# Altium project Miniscope_USB_Control.PrjPcb
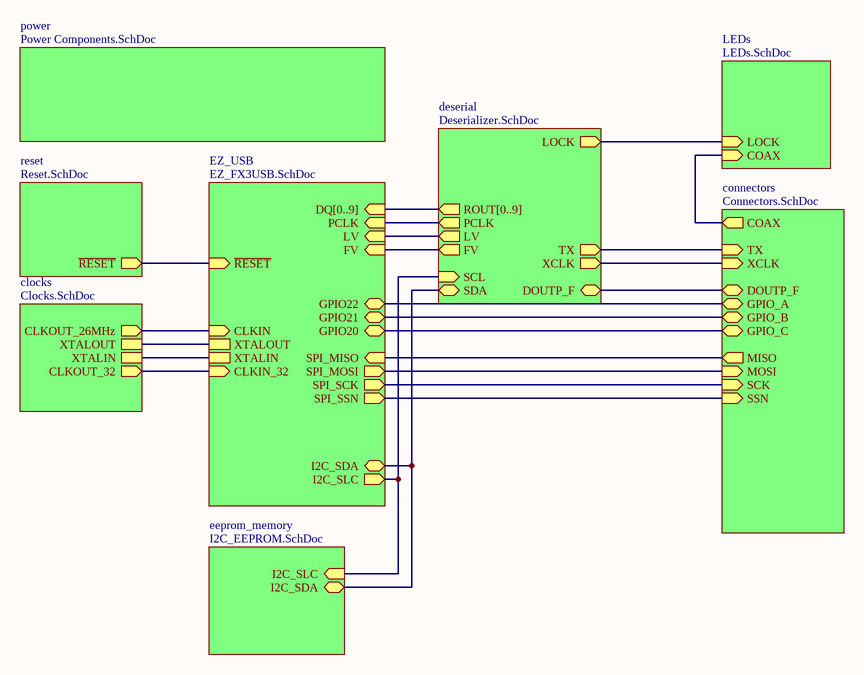
[diagram p0: USB_Control.SchDoc]
9 sheets, 208 parts. Net scope: hierarchical (ports join the sheet entries above them; power ports are global).
Board file: USB_Control.PcbDoc
Sheets:
  USB_Control.SchDoc
    deserial = Deserializer.SchDoc
    EZ_USB = EZ_FX3USB.SchDoc
    eeprom_memory = I2C_EEPROM.SchDoc
    power = Power Components.SchDoc
    connectors = Connectors.SchDoc
    reset = Reset.SchDoc
    clocks = Clocks.SchDoc
    LEDs = LEDs.SchDoc

## Sheet USB_Control.SchDoc
size A

### Sub-sheets
clocks = Clocks.SchDoc: XTALOUT, XTALIN, CLKOUT_32 (out), CLKOUT_26MHz (out)
connectors = Connectors.SchDoc: GPIO_A (bidir), GPIO_B (bidir), GPIO_C (bidir), DOUTP_F (bidir), MISO (out), MOSI (in), SCK (in), SSN (in), COAX (out), XCLK (in), TX (in)
deserial = Deserializer.SchDoc: LOCK (out), LV (out), FV (out), PCLK (out), DOUTP_F (bidir), SCL (in), SDA (bidir), ROUT[0..9] (out), XCLK (out), TX (out)
eeprom_memory = I2C_EEPROM.SchDoc: I2C_SDA (bidir), I2C_SLC (in)
EZ_USB = EZ_FX3USB.SchDoc: PCLK (in), SPI_SCK (out), SPI_SSN (out), SPI_MISO (in), SPI_MOSI (out), CLKIN_32 (in), XTALOUT, XTALIN, I2C_SDA (bidir), I2C_SLC (out), ~{RESET} (in), GPIO20 (bidir), DQ[0..9] (in), GPIO22 (bidir), GPIO21 (bidir), LV (in), FV (in), CLKIN (in)
LEDs = LEDs.SchDoc: LOCK (in), COAX (in)
power = Power Components.SchDoc: no entries
reset = Reset.SchDoc: ~{RESET} (out)

### Nets
CLKIN: sheet EZ_USB/CLKIN, sheet clocks/CLKOUT_26MHz
CLKIN_32: sheet EZ_USB/CLKIN_32, sheet clocks/CLKOUT_32
XTALIN: sheet EZ_USB/XTALIN, sheet clocks/XTALIN
XTALOUT: sheet EZ_USB/XTALOUT, sheet clocks/XTALOUT
NetC21_1: sheet deserial/DOUTP_F, sheet connectors/DOUTP_F
NetC78_1: sheet EZ_USB/~{RESET}, sheet reset/~{RESET}
NetJ3_1: sheet EZ_USB/GPIO22, sheet connectors/GPIO_A
NetJ5_1: sheet EZ_USB/GPIO20, sheet connectors/GPIO_C
NetJ8_1: sheet EZ_USB/SPI_MOSI, sheet connectors/MOSI
NetJ8_2: sheet EZ_USB/SPI_SCK, sheet connectors/SCK
NetJ8_3: sheet EZ_USB/SPI_MISO, sheet connectors/MISO
NetJ8_4: sheet EZ_USB/SPI_SSN, sheet connectors/SSN
NetJ9_2: sheet connectors/COAX, sheet LEDs/COAX
NetR9_1: sheet deserial/FV, sheet EZ_USB/FV
NetR10_1: sheet deserial/LV, sheet EZ_USB/LV
NetR12_0: sheet deserial/SCL, sheet EZ_USB/I2C_SLC, sheet eeprom_memory/I2C_SLC
NetR13_1: sheet EZ_USB/GPIO21, sheet connectors/GPIO_B
NetR14_0: sheet deserial/SDA, sheet EZ_USB/I2C_SDA, sheet eeprom_memory/I2C_SDA
NetR18_1: sheet deserial/PCLK, sheet EZ_USB/PCLK
NetR61_1: sheet deserial/LOCK, sheet LEDs/LOCK
NetU4_11: sheet deserial/XCLK, sheet connectors/XCLK
NetU4_12: sheet deserial/TX, sheet connectors/TX

### Buses and harness runs
bus sheet deserial/ROUT[0..9] = sheet EZ_USB/DQ[0..9]

## Sheet Deserializer.SchDoc
size A
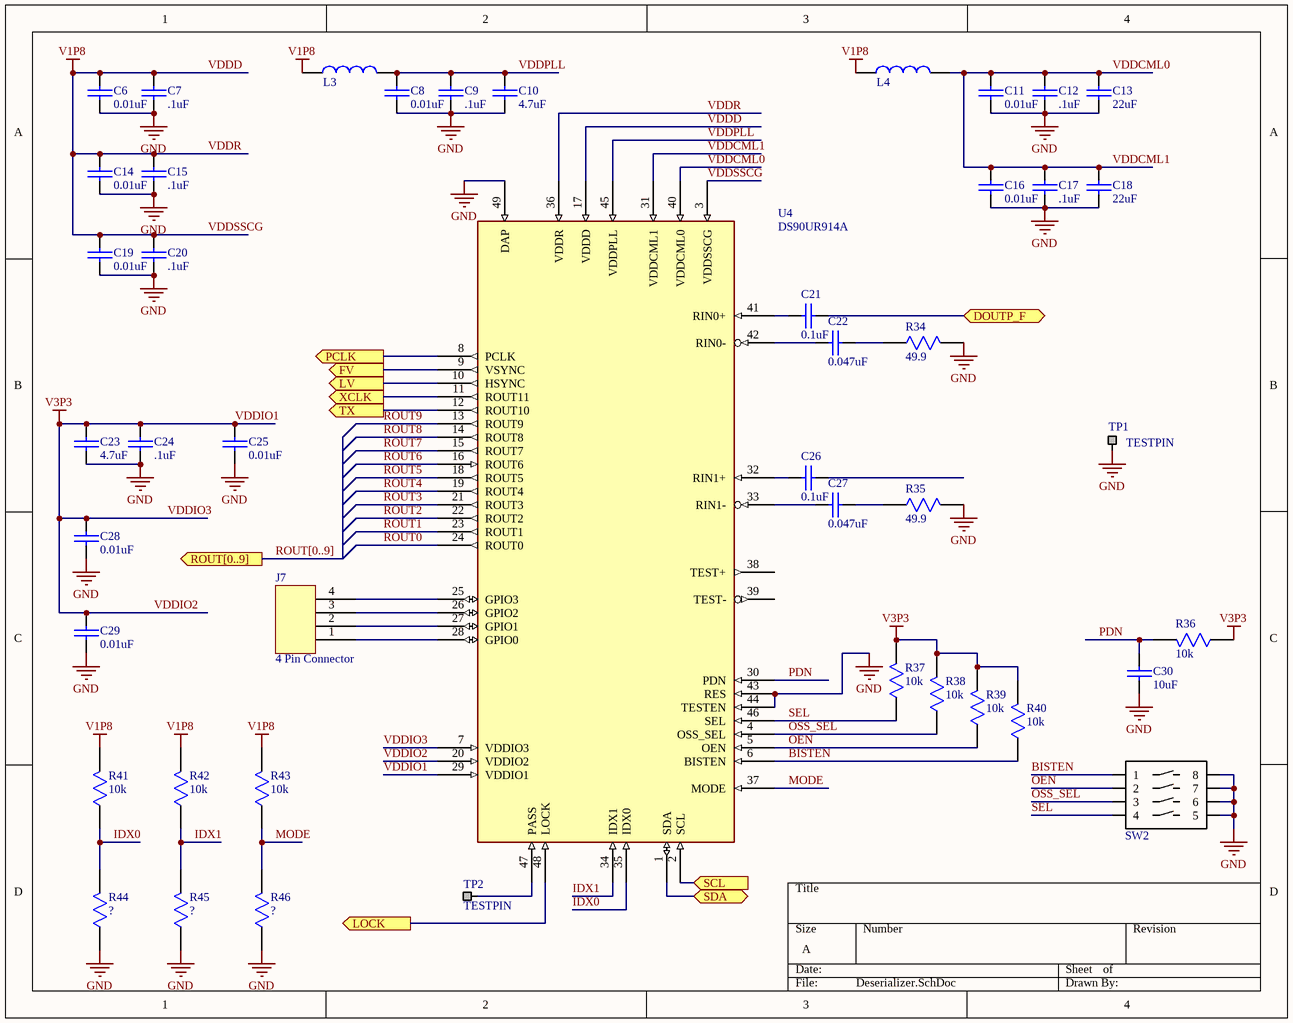
[diagram p1: Deserializer.SchDoc]

### Parts
C6  0.01uF  [SMD Capacitor 0603]
C7  .1uF  [SMD Capacitor 0603]
C8  0.01uF  [SMD Capacitor 0603]
C9  .1uF  [SMD Capacitor 0603]
C10  4.7uF  [SMD Capacitor 0603]
C11  0.01uF  [SMD Capacitor 0603]
C12  .1uF  [SMD Capacitor 0603]
C13  22uF  [SMD Capacitor 0603]
C14  0.01uF  [SMD Capacitor 0603]
C15  .1uF  [SMD Capacitor 0603]
C16  0.01uF  [SMD Capacitor 0603]
C17  .1uF  [SMD Capacitor 0603]
C18  22uF  [SMD Capacitor 0603]
C19  0.01uF  [SMD Capacitor 0603]
C20  .1uF  [SMD Capacitor 0603]
C21  0.1uF  [SMD CAP 0402]
C22  0.047uF  [SMD CAP 0402]
C23  4.7uF  [SMD Capacitor 0603]
C24  .1uF  [SMD Capacitor 0603]
C25  0.01uF  [SMD Capacitor 0603]
C26  0.1uF  [SMD CAP 0402]
C27  0.047uF  [SMD CAP 0402]
C28  0.01uF  [SMD Capacitor 0603]
C29  0.01uF  [SMD Capacitor 0603]
C30  10uF  [SMD Capacitor 0603]
J7  4 Pin Connector  [4Pin Verital 0.1"]
L3  Ferrite Bead  [BLM18KG601SN1D]  (value not drawn)
L4  Ferrite Bead  [BLM18KG601SN1D]  (value not drawn)
R34  49.9  [SMD RES 0402]
R35  49.9  [SMD RES 0402]
R36  10k  [SMD Resistor 0603]
R37  10k  [SMD Resistor 0603]
R38  10k  [SMD Resistor 0603]
R39  10k  [SMD Resistor 0603]
R40  10k  [SMD Resistor 0603]
R41  10k  [SMD Resistor 0603]
R42  10k  [SMD Resistor 0603]
R43  10k  [SMD Resistor 0603]
R44  ?  [SMD Resistor 0603]
R45  ?  [SMD Resistor 0603]
R46  ?  [SMD Resistor 0603]
SW2  SW_DIP_4Position  [218-4LPST]  (value not drawn)
TP1  TESTPIN  [TESTPIN]
TP2  TESTPIN  [TESTPIN]
U4  DS90UR914A  [WQFN48 for DS90UB914A]

### Ports
DOUTP_F (bidir), FV (out), LOCK (out), LV (out), PCLK (out), ROUT[0..9] (out), SCL (in), SDA (bidir), TX (out), XCLK (out)

### Nets
GND: C6.1 C7.1 C8.1 C9.1 C10.1 C11.1 C12.1 C13.1 C14.1 C15.1 C16.1 C17.1 C18.1 C19.1 C20.1 C23.1 C24.1 C25.1 C28.1 C29.1 C30.1 R34.1 R35.1 R44.0 R45.0 R46.0 SW2.5 SW2.6 SW2.7 SW2.8 TP1.1 U4.43(RES) U4.44(TESTEN) U4.49(DAP)
VDDD: C6.0 C7.0 C14.0 C15.0 C19.0 C20.0 L3.1 L4.1 R41.1 R42.1 R43.1 U4.3(VDDSSCG) U4.17(VDDD) U4.36(VDDR)  [also labelled V1P8, VDDR, VDDSSCG]
VDDIO1: C23.0 C24.0 C25.0 C28.0 C29.0 R36.0 R37.1 R38.1 R39.1 R40.1 U4.7(VDDIO3) U4.20(VDDIO2) U4.29(VDDIO1)  [also labelled V3P3, VDDIO2, VDDIO3]
BISTEN: R40.0 SW2.1 U4.6(BISTEN)
IDX0: R41.0 R44.1 U4.35(IDX0)
IDX1: R42.0 R45.1 U4.34(IDX1)
MODE: R43.0 R46.1 U4.37(MODE)
OEN: R39.0 SW2.2 U4.5(OEN)
OSS_SEL: R38.0 SW2.3 U4.4(OSS_SEL)
PDN: C30.0 R36.1 U4.30(PDN)
ROUT0: U4.24(ROUT0)  [project net DQ0]
ROUT1: U4.23(ROUT1)  [project net DQ1]
ROUT2: U4.22(ROUT2)  [project net DQ2]
ROUT3: U4.21(ROUT3)  [project net DQ3]
ROUT4: U4.19(ROUT4)  [project net DQ4]
ROUT5: U4.18(ROUT5)  [project net DQ5]
ROUT6: U4.16(ROUT6)  [project net DQ6]
ROUT7: U4.15(ROUT7)  [project net DQ7]
ROUT8: U4.14(ROUT8)  [project net DQ8]
ROUT9: U4.13(ROUT9)  [project net DQ9]
SEL: R37.0 SW2.4 U4.46(SEL)
VDDCML0: C11.0 C12.0 C13.0 C16.0 C17.0 C18.0 L4.2 U4.31(VDDCML1) U4.40(VDDCML0)  [also labelled VDDCML1]
VDDPLL: C8.0 C9.0 C10.0 L3.2 U4.45(VDDPLL)
NetC21_0: C21.0 U4.41(RIN0+)
NetC21_1: C21.1 ; port DOUTP_F
NetC22_0: C22.0 U4.42(RIN0-)
NetC22_1: C22.1 R34.0
NetC26_0: C26.0 U4.32(RIN1+)
NetC27_0: C27.0 U4.33(RIN1-)
NetC27_1: C27.1 R35.0
NetJ7_1: J7.1 U4.28(GPIO0)
NetJ7_2: J7.2 U4.27(GPIO1)
NetJ7_3: J7.3 U4.26(GPIO2)
NetJ7_4: J7.4 U4.25(GPIO3)
NetR9_1: U4.9(VSYNC) ; port FV
NetR10_1: U4.10(HSYNC) ; port LV
NetR12_0: U4.2(SCL) ; port SCL
NetR14_0: U4.1(SDA) ; port SDA
NetR18_1: U4.8(PCLK) ; port PCLK
NetR61_1: U4.48(LOCK) ; port LOCK
NetTP2_1: TP2.1 U4.47(PASS)
NetU4_11: U4.11(ROUT11) ; port XCLK
NetU4_12: U4.12(ROUT10) ; port TX

Not connected (* = marked no-connect by the designer): C26 1; U4 38(TEST+) 39(TEST-)

### Buses and harness runs
bus ROUT[0..9] = port ROUT[0..9]

### Library data of the parts
C6-C30 = Capacitor: Value: C?
R34-R46 = Resistor: Value: ?
TP1 TP2 = TESTPIN: TESTPIN SINGLE PIN HEADER; Manufacturer 1: Sharon Long Industries; Manufacturer Part Number 1: Cut-it-yourself; Reel: TH; Supplier 1: Sharon Long Industries; Supplier 1 Part number: Cut-It-Yourself

## Sheet EZ_FX3USB.SchDoc
size A
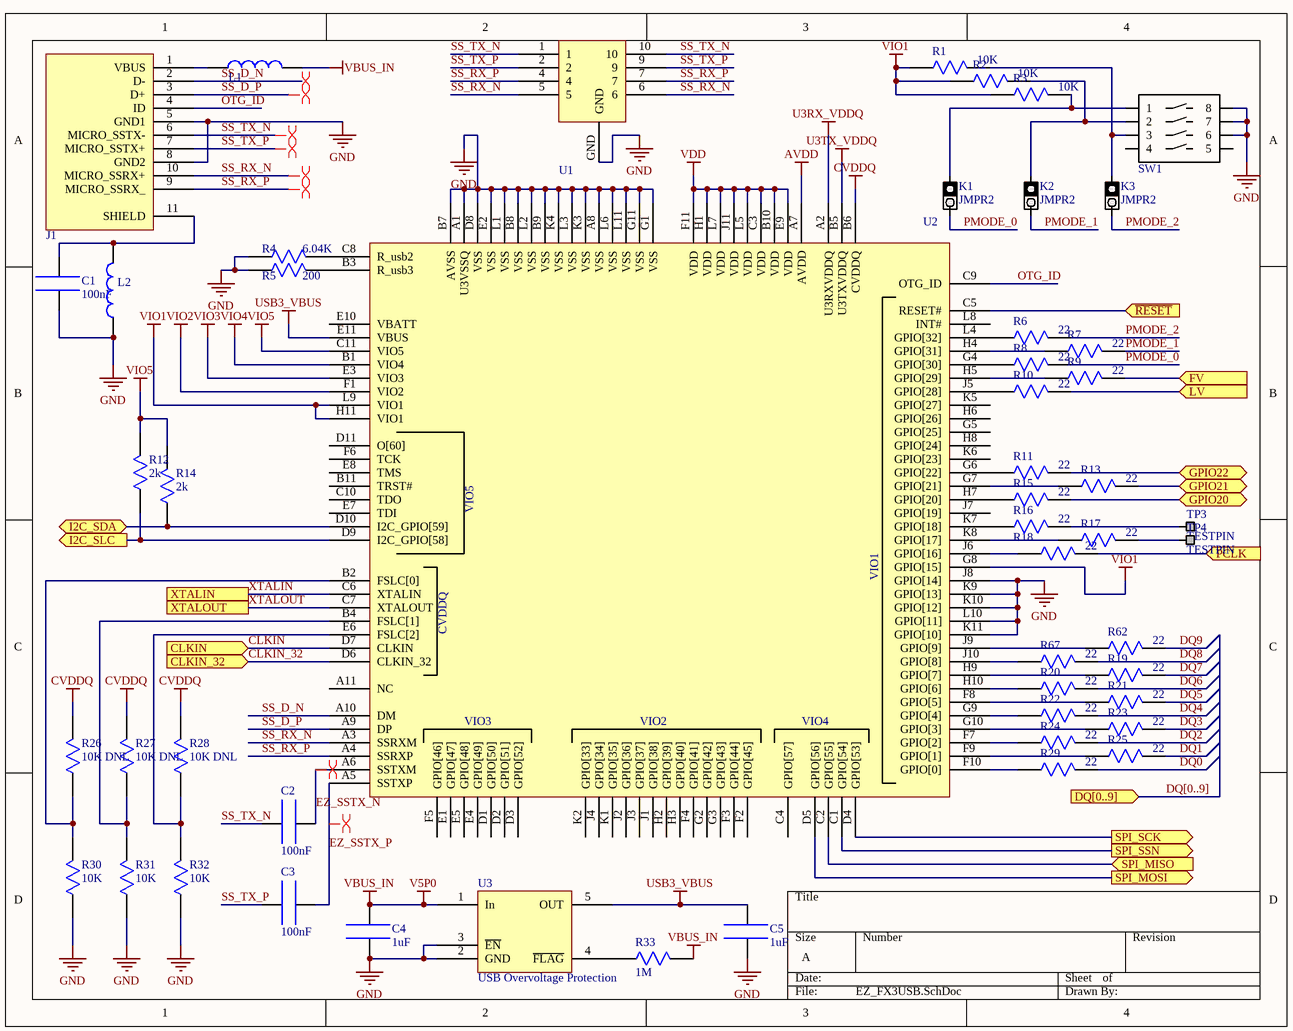
[diagram p2: EZ_FX3USB.SchDoc]

### Parts
C1  value 100nF  [SMD Capacitor 0603]  (hidden comment: Capacitor)
C2  value 100nF  [SMD Capacitor 0603]  (hidden comment: Capacitor)
C3  value 100nF  [SMD Capacitor 0603]  (hidden comment: Capacitor)
C4  value 1uF  [SMD Capacitor 0603]  (hidden comment: Capacitor)
C5  value 1uF  [SMD Capacitor 0603]  (hidden comment: Capacitor)
J1  USB3 MicroB  [PCBComponent_1]  (value not drawn)
K1  JMPR2  [JMPR2]
K2  JMPR2  [JMPR2]
K3  JMPR2  [JMPR2]
L1  Ferrite Bead  [BLM21PG221SN1D_0805]  (value not drawn)
L2  Ferrite Bead  [BLM21PG221SN1D_0805]  (value not drawn)
R1  10K  [SMD Resistor 0603]
R2  value 10K  [SMD Resistor 0603]  (hidden comment: Resistor)
R3  value 10K  [SMD Resistor 0603]  (hidden comment: Resistor)
R4  value 6.04K  [SMD Resistor 0603]  (hidden comment: Resistor)
R5  value 200  [SMD Resistor 0603]  (hidden comment: Resistor)
R6  value 22  [SMD Resistor 0603]  (hidden comment: "=Value")
R7  value 22  [SMD Resistor 0603]  (hidden comment: Resistor)
R8  value 22  [SMD Resistor 0603]  (hidden comment: Resistor)
R9  value 22  [SMD Resistor 0603]  (hidden comment: Resistor)
R10  value 22  [SMD Resistor 0603]  (hidden comment: Resistor)
R11  value 22  [SMD Resistor 0603]  (hidden comment: Resistor)
R12  value 2k  [SMD Resistor 0603]  (hidden comment: Resistor)
R13  value 22  [SMD Resistor 0603]  (hidden comment: Resistor)
R14  value 2k  [SMD Resistor 0603]  (hidden comment: Resistor)
R15  value 22  [SMD Resistor 0603]  (hidden comment: Resistor)
R16  value 22  [SMD Resistor 0603]  (hidden comment: Resistor)
R17  value 22  [SMD Resistor 0603]  (hidden comment: Resistor)
R18  value 22  [SMD Resistor 0603]  (hidden comment: Resistor)
R19  value 22  [SMD Resistor 0603]  (hidden comment: Resistor)
R20  value 22  [SMD Resistor 0603]  (hidden comment: Resistor)
R21  value 22  [SMD Resistor 0603]  (hidden comment: Resistor)
R22  value 22  [SMD Resistor 0603]  (hidden comment: Resistor)
R23  value 22  [SMD Resistor 0603]  (hidden comment: Resistor)
R24  value 22  [SMD Resistor 0603]  (hidden comment: Resistor)
R25  value 22  [SMD Resistor 0603]  (hidden comment: Resistor)
R26  value 10K DNL  [SMD Resistor 0603]  (hidden comment: Resistor)
R27  value 10K DNL  [SMD Resistor 0603]  (hidden comment: Resistor)
R28  value 10K DNL  [SMD Resistor 0603]  (hidden comment: Resistor)
R29  value 22  [SMD Resistor 0603]  (hidden comment: Resistor)
R30  value 10K  [SMD Resistor 0603]  (hidden comment: Resistor)
R31  value 10K  [SMD Resistor 0603]  (hidden comment: Resistor)
R32  value 10K  [SMD Resistor 0603]  (hidden comment: Resistor)
R33  value 1M  [SMD Resistor 0603]  (hidden comment: Resistor)
R62  value 22  [SMD Resistor 0603]  (hidden comment: Resistor)
R67  value 22  [SMD Resistor 0603]  (hidden comment: Resistor)
SW1  SW_DIP_4Position  [218-4LPST]  (value not drawn)
TP3  TESTPIN  [TESTPIN]
TP4  TESTPIN  [TESTPIN]
U1  ESD_4Channel  [SP3010-04UTG]  (value not drawn)
U2  EZ FX3 USB  [BGA121C80P11X11_1000X1000X100]  (value not drawn)
U3  USB Overvoltage Protection  [TSOP-5 _ NCP361SNT1G]

### Ports
CLKIN (in), CLKIN_32 (in), DQ[0..9] (in), FV (in), GPIO20 (bidir), GPIO21 (bidir), GPIO22 (bidir), I2C_SDA (bidir), I2C_SLC (out), LV (in), PCLK (in), SPI_MISO (in), SPI_MOSI (out), SPI_SCK (out), SPI_SSN (out), XTALIN, XTALOUT, ~{RESET} (in)

### Nets
AVDD: U2.A7(AVDD)
CVDDQ: R26.1 R27.1 R28.1 U2.B6(CVDDQ)
GND: C1.0 C4.0 C5.0 J1.5(GND1) J1.8(GND2) L2.1 R4.0 R5.0 R30.0 R31.0 R32.0 SW1.6 SW1.7 SW1.8 U1.GND U2.A1(U3VSSQ) U2.A8(VSS) U2.B7(AVSS) U2.B8(VSS) U2.B9(VSS) U2.D8(VSS) U2.E2(VSS) U2.G1(VSS) U2.G11(VSS) U2.J8(GPIO[14]) U2.K3(VSS) U2.K4(VSS) U2.K9(GPIO[13]) U2.K10(GPIO[12]) U2.K11(GPIO[10]) U2.L1(VSS) U2.L2(VSS) U2.L3(VSS) U2.L6(VSS) U2.L10(GPIO[11]) U2.L11(VSS) U3.2(GND) U3.3(~{EN})
U3RX_VDDQ: U2.A2(U3RXVDDQ)
U3TX_VDDQ: U2.B5(U3TXVDDQ)
USB3_VBUS: C5.1 U2.E11(VBUS) U3.5(OUT)
V5P0: C4.1 L1.2 R33.1 U3.1(In)  [also labelled VBUS_IN]
VDD: U2.B10(VDD) U2.C3(VDD) U2.E9(VDD) U2.F11(VDD) U2.H1(VDD) U2.J11(VDD) U2.L5(VDD) U2.L7(VDD)
VIO1: R1.0 R2.0 R3.0 R12.1 R14.1 U2.B1(VIO4) U2.C11(VIO5) U2.E3(VIO3) U2.F1(VIO2) U2.G8(GPIO[15]) U2.H11(VIO1) U2.L9(VIO1)  [also labelled VIO2, VIO3, VIO4, VIO5]  [project net VDDIO1]
CLKIN: U2.D7(CLKIN) ; port CLKIN
CLKIN_32: U2.D6(CLKIN_32) ; port CLKIN_32
DQ0: R29.1
DQ1: R25.1
DQ2: R24.1
DQ3: R23.1
DQ4: R22.1
DQ5: R21.1
DQ6: R20.1
DQ7: R19.1
DQ8: R67.1
DQ9: R62.1
EZ_SSTX_N: C2.1 U2.A6(SSTXM)
EZ_SSTX_P: C3.1 U2.A5(SSTXP)
OTG_ID: J1.4(ID) U2.C9(OTG_ID)
PMODE_0: K1.2 R8.1
PMODE_1: K2.2 R7.1
PMODE_2: K3.2 R6.1
SS_D_N: J1.2(D-) U2.A10(DM)
SS_D_P: J1.3(D+) U2.A9(DP)
SS_RX_N: J1.10(MICRO_SSRX+) U1.5 U1.6 U2.A3(SSRXM)
SS_RX_P: J1.9(MICRO_SSRX_) U1.4 U1.7 U2.A4(SSRXP)
SS_TX_N: C2.0 J1.6(MICRO_SSTX-) U1.1 U1.10
SS_TX_P: C3.0 J1.7(MICRO_SSTX+) U1.2 U1.9
XTALIN: U2.C6(XTALIN) ; port XTALIN
XTALOUT: U2.C7(XTALOUT) ; port XTALOUT
NetC1_1: C1.1 J1.11(SHIELD) L2.2
NetC78_1: U2.C5(RESET#) ; port ~{RESET}
NetJ1_1: J1.1(VBUS) L1.1
NetJ3_1: R11.1 ; port GPIO22
NetJ5_1: R15.1 ; port GPIO20
NetJ8_1: U2.D5(GPIO[56]) ; port SPI_MOSI
NetJ8_2: U2.D4(GPIO[53]) ; port SPI_SCK
NetJ8_3: U2.C2(GPIO[55]) ; port SPI_MISO
NetJ8_4: U2.C1(GPIO[54]) ; port SPI_SSN
NetK1_1: K1.1 R3.1 SW1.1
NetK2_1: K2.1 R2.1 SW1.2
NetK3_1: K3.1 R1.1 SW1.3
NetR4_1: R4.1 U2.C8(R_usb2)
NetR5_1: R5.1 U2.B3(R_usb3)
NetR6_0: R6.0 U2.L4(GPIO[32])
NetR7_0: R7.0 U2.H4(GPIO[31])
NetR8_0: R8.0 U2.G4(GPIO[30])
NetR9_0: R9.0 U2.H5(GPIO[29])
NetR9_1: R9.1 ; port FV
NetR10_0: R10.0 U2.J5(GPIO[28])
NetR10_1: R10.1 ; port LV
NetR11_0: R11.0 U2.G6(GPIO[22])
NetR12_0: R12.0 U2.D9(I2C_GPIO[58]) ; port I2C_SLC
NetR13_0: R13.0 U2.G7(GPIO[21])
NetR13_1: R13.1 ; port GPIO21
NetR14_0: R14.0 U2.D10(I2C_GPIO[59]) ; port I2C_SDA
NetR15_0: R15.0 U2.H7(GPIO[20])
NetR16_0: R16.0 U2.K7(GPIO[18])
NetR16_1: R16.1 TP3.1
NetR17_0: R17.0 U2.K8(GPIO[17])
NetR17_1: R17.1 TP4.1
NetR18_0: R18.0 U2.J6(GPIO[16])
NetR18_1: R18.1 ; port PCLK
NetR19_0: R19.0 U2.H9(GPIO[7])
NetR20_0: R20.0 U2.H10(GPIO[6])
NetR21_0: R21.0 U2.F8(GPIO[5])
NetR22_0: R22.0 U2.G9(GPIO[4])
NetR23_0: R23.0 U2.G10(GPIO[3])
NetR24_0: R24.0 U2.F7(GPIO[2])
NetR25_0: R25.0 U2.F9(GPIO[1])
NetR26_0: R26.0 R30.1 U2.B2(FSLC[0])
NetR27_0: R27.0 R31.1 U2.B4(FSLC[1])
NetR28_0: R28.0 R32.1 U2.E6(FSLC[2])
NetR29_0: R29.0 U2.F10(GPIO[0])
NetR33_0: R33.0 U3.4(~{FLAG})
NetR62_0: R62.0 U2.J9(GPIO[9])
NetR67_0: R67.0 U2.J10(GPIO[8])

Not connected (* = marked no-connect by the designer): SW1 4 5; U2 A11(NC) B11(TRST#) C4(GPIO[57]) C10(TDO) D1(GPIO[50]) D2(GPIO[51]) D3(GPIO[52]) D11(O[60]) E1(GPIO[47]) E4(GPIO[49]) E5(GPIO[48]) E7(TDI) E8(TMS) E10(VBATT) F2(GPIO[45]) F3(GPIO[44]) F4(GPIO[41]) F5(GPIO[46]) F6(TCK) G2(GPIO[42]) G3(GPIO[43]) G5(GPIO[25]) H2(GPIO[39]) H3(GPIO[40]) H6(GPIO[26]) H8(GPIO[24]) J1(GPIO[38]) J2(GPIO[36]) J3(GPIO[37]) J4(GPIO[34]) J7(GPIO[19]) K1(GPIO[35]) K2(GPIO[33]) K5(GPIO[27]) K6(GPIO[23]) L8(INT#)

### Buses and harness runs
bus DQ[0..9] = port DQ[0..9]

### Layout directives
differential pair: EZ_SSTX_N, EZ_SSTX_P, SS_D_N, SS_D_P, SS_RX_N, SS_RX_P, SS_TX_N, SS_TX_P

### Library data of the parts
K1-K3 = JMPR2: JMPR2 OPEN BY DEFAULT; Manufacturer: Sullins Connector Solutions; Manufacturer Part Number: PBC36SAAN; Supplier 1: Digi-Key; Supplier Part Number 1: S1011E-36-ND; Reel: Open
R1 R6 = Resistor
  R1: Value: 10K
TP3 TP4 = TESTPIN: as TP1 on sheet Deserializer; Supplier 1: Sharon Long Industries; Supplier 1 Part number: Cut-It-Yourself

## Sheet I2C_EEPROM.SchDoc
size A
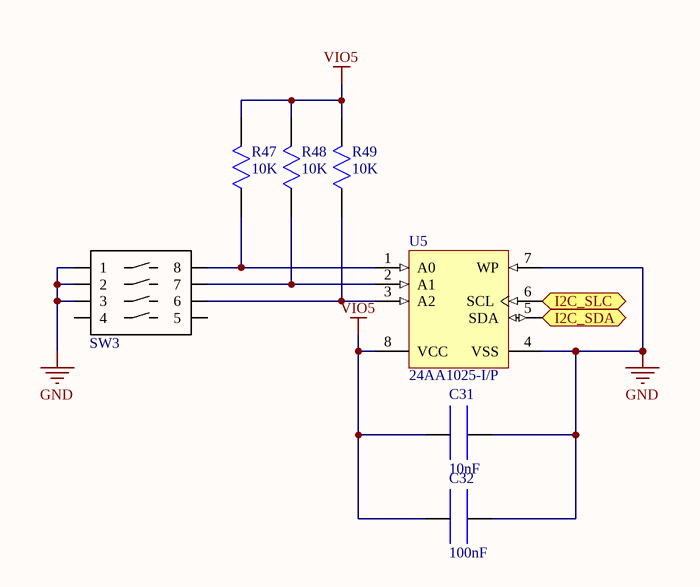
[diagram p3: I2C_EEPROM.SchDoc]

### Parts
C31  value 10nF  [SMD Capacitor 0603]  (hidden comment: Capacitor)
C32  value 100nF  [SMD Capacitor 0603]  (hidden comment: Capacitor)
R47  value 10K  [SMD Resistor 0603]  (hidden comment: Resistor)
R48  value 10K  [SMD Resistor 0603]  (hidden comment: Resistor)
R49  value 10K  [SMD Resistor 0603]  (hidden comment: Resistor)
SW3  SW_DIP_4Position  [218-4LPST]  (value not drawn)
U5  24AA1025-I/P  [PDIP300-P8]

### Ports
I2C_SDA (bidir), I2C_SLC (in)

### Nets
GND: C31.1 C32.1 SW3.1 SW3.2 SW3.3 U5.4(VSS) U5.7(WP)
VIO5: C31.0 C32.0 R47.1 R48.1 R49.1 U5.8(VCC)  [project net VDDIO1]
NetR12_0: U5.6(SCL) ; port I2C_SLC
NetR14_0: U5.5(SDA) ; port I2C_SDA
NetR47_0: R47.0 SW3.8 U5.1(A0)
NetR48_0: R48.0 SW3.7 U5.2(A1)
NetR49_0: R49.0 SW3.6 U5.3(A2)

Not connected (* = marked no-connect by the designer): SW3 4 5

### Library data of the parts
U5 = 24AA1025-I/P: 1 Mbit, 400kHz, 1.7V, I2C Serial EEPROM, 8-Pin PDIP, Industrial Temperature; Manufacturer: Microchip; DatasheetVersion: revF, Oct-2008; PackageVersion: revBB, Aug-2009; PackageReference: PDIP300-P8; PackageDescription: 8-Lead Plastic Dual In-Line (P) - 300 mil Body [PDIP]; Supplier 1: Digi-Key; Supplier Part Number 1: 24AA1025-I/P-ND; Supplier 2: Farnell; Supplier Part Number 2: 1467720; Supplier 3: Newark; Supplier Part Number 3: 56K7661; Supplier 4: Mouser; Supplier Part Number 4: 579-24AA1025-I/P; Mounting Technology: Through Hole; Code_JEDEC: MS-001; PartNumber: 24AA1025-I/P; ComponentLink1Description: Manufacturer URL; ComponentLink1URL: http://www.microchip.com/; ComponentLink2Description: Datasheet; ComponentLink2URL: http://ww1.microchip.com/downloads/en/DeviceDoc/21941F.pdf; ComponentLink3Description: Package Specification; ComponentLink3URL: http://www.microchip.com/stellent/groups/techpub_sg/documents/packagingspec/en012702.pdf

## Sheet Power Components.SchDoc
size A
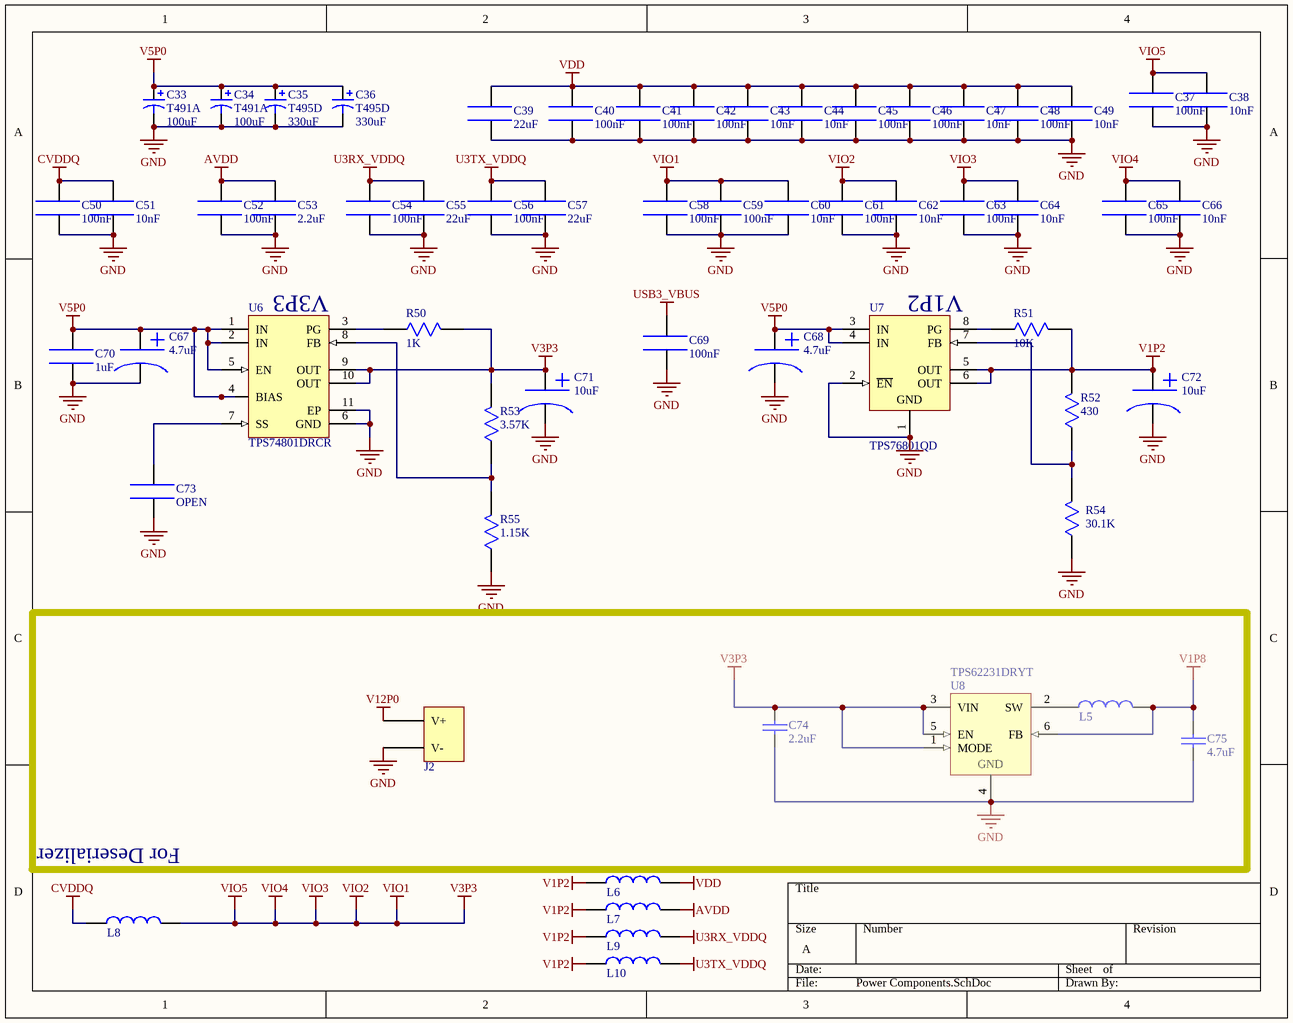
[diagram p4: Power Components.SchDoc]

### Parts
C33  T491A  value 100uF  [A]
C34  T491A  value 100uF  [A]
C35  T495D  value 330uF  [D]
C36  T495D  value 330uF  [D]
C37  value 100nF  [SMD Capacitor 0603]  (hidden comment: Capacitor)
C38  value 10nF  [SMD Capacitor 0603]  (hidden comment: Capacitor)
C39  value 22uF  [SMD Capacitor 0603]  (hidden comment: Capacitor)
C40  value 100nF  [SMD Capacitor 0603]  (hidden comment: Capacitor)
C41  value 100nF  [SMD Capacitor 0603]  (hidden comment: Capacitor)
C42  value 100nF  [SMD Capacitor 0603]  (hidden comment: Capacitor)
C43  value 10nF  [SMD Capacitor 0603]  (hidden comment: Capacitor)
C44  value 10nF  [SMD Capacitor 0603]  (hidden comment: Capacitor)
C45  value 100nF  [SMD Capacitor 0603]  (hidden comment: Capacitor)
C46  value 100nF  [SMD Capacitor 0603]  (hidden comment: Capacitor)
C47  value 10nF  [SMD Capacitor 0603]  (hidden comment: Capacitor)
C48  value 100nF  [SMD Capacitor 0603]  (hidden comment: Capacitor)
C49  value 10nF  [SMD Capacitor 0603]  (hidden comment: Capacitor)
C50  value 100nF  [SMD Capacitor 0603]  (hidden comment: Capacitor)
C51  value 10nF  [SMD Capacitor 0603]  (hidden comment: Capacitor)
C52  value 100nF  [SMD Capacitor 0603]  (hidden comment: Capacitor)
C53  value 2.2uF  [SMD Capacitor 0603]  (hidden comment: Capacitor)
C54  value 100nF  [SMD Capacitor 0603]  (hidden comment: Capacitor)
C55  value 22uF  [SMD Capacitor 0603]  (hidden comment: Capacitor)
C56  value 100nF  [SMD Capacitor 0603]  (hidden comment: Capacitor)
C57  value 22uF  [SMD Capacitor 0603]  (hidden comment: Capacitor)
C58  value 100nF  [SMD Capacitor 0603]  (hidden comment: Capacitor)
C59  value 100nF  [SMD Capacitor 0603]  (hidden comment: Capacitor)
C60  value 10nF  [SMD Capacitor 0603]  (hidden comment: Capacitor)
C61  value 100nF  [SMD Capacitor 0603]  (hidden comment: Capacitor)
C62  value 10nF  [SMD Capacitor 0603]  (hidden comment: Capacitor)
C63  value 100nF  [SMD Capacitor 0603]  (hidden comment: Capacitor)
C64  value 10nF  [SMD Capacitor 0603]  (hidden comment: Capacitor)
C65  value 100nF  [SMD Capacitor 0603]  (hidden comment: Capacitor)
C66  value 10nF  [SMD Capacitor 0603]  (hidden comment: Capacitor)
C67  value 4.7uF  [Capacitor Polarized 0603]  (hidden comment: Capacitor Polarized)
C68  value 4.7uF  [Capacitor Polarized 0603]  (hidden comment: Capacitor Polarized)
C69  value 100nF  [SMD Capacitor 0603]  (hidden comment: Capacitor)
C70  value 1uF  [SMD Capacitor 0603]  (hidden comment: Capacitor)
C71  value 10uF  [Capacitor Polarized 0603]  (hidden comment: Capacitor Polarized)
C72  value 10uF  [Capacitor Polarized 0603]  (hidden comment: Capacitor Polarized)
C73  value OPEN  [SMD Capacitor 0603]  (hidden comment: Capacitor)
C74  2.2uF  [SMD Capacitor 0603]
C75  4.7uF  [SMD Capacitor 0603]
J2  DC-Power Jack  [PCBComponent_1 - duplicate]  (value not drawn)
L5  Ferrite Bead  [LQM21PN2R2MC0D]  (value not drawn)
L6  Ferrite Bead  [MPZ2012S601A]  (value not drawn)
L7  Ferrite Bead  [MPZ2012S601A]  (value not drawn)
L8  Ferrite Bead  [MPZ2012S601A]  (value not drawn)
L9  Ferrite Bead  [MPZ2012S601A]  (value not drawn)
L10  Ferrite Bead  [MPZ2012S601A]  (value not drawn)
R50  value 1K  [SMD Resistor 0603]  (hidden comment: Resistor)
R51  value 10K  [SMD Resistor 0603]  (hidden comment: Resistor)
R52  value 430  [SMD Resistor 0603]  (hidden comment: Resistor)
R53  value 3.57K  [SMD Resistor 0603]  (hidden comment: Resistor)
R54  value 30.1K  [SMD Resistor 0603]  (hidden comment: Resistor)
R55  value 1.15K  [SMD Resistor 0603]  (hidden comment: Resistor)
U6  TPS74801DRCR  [TI-DRC10-2400X1650TP_V]
U7  TPS76801QD  [TI-D8_N]
U8  TPS62231DRYT  [DRY6]

### Blocks framed on the sheet
For Deserializer: C74 C75 J2 L5 U8

### Nets
AVDD: C52.1 C53.1 L7.2
CVDDQ: C50.1 C51.1 L8.1
GND: C33.2 C34.2 C35.2 C36.2 C37.0 C38.0 C39.0 C40.0 C41.0 C42.0 C43.0 C44.0 C45.0 C46.0 C47.0 C48.0 C49.0 C50.0 C51.0 C52.0 C53.0 C54.0 C55.0 C56.0 C57.0 C58.0 C59.0 C60.0 C61.0 C62.0 C63.0 C64.0 C65.0 C66.0 C67.- C68.- C69.0 C70.0 C71.- C72.- C73.0 C74.1 C75.1 J2.V- R54.0 R55.0 U6.6(GND) U6.11(EP) U7.1(GND) U7.2(~{EN}) U8.4(GND)
U3RX_VDDQ: C54.1 C55.1 L9.2
U3TX_VDDQ: C56.1 C57.1 L10.2
USB3_VBUS: C69.1
V1P2: C72.+ L6.1 L7.1 L9.1 L10.1 R51.1 R52.1 U7.5(OUT) U7.6(OUT)
V1P8: C75.0 L5.2 U8.6(FB)  [project net VDDD]
V3P3: C37.1 C38.1 C58.1 C59.1 C60.1 C61.1 C62.1 C63.1 C64.1 C65.1 C66.1 C71.+ C74.0 L8.2 R50.1 R53.1 U6.9(OUT) U6.10(OUT) U8.1(MODE) U8.3(VIN) U8.5(EN)  [also labelled VIO1, VIO2, VIO3, VIO4, VIO5]  [project net VDDIO1]
V5P0: C33.1 C34.1 C35.1 C36.1 C67.+ C68.+ C70.1 U6.1(IN) U6.2(IN) U6.4(BIAS) U6.5(EN) U7.3(IN) U7.4(IN)
V12P0: J2.V+
VDD: C39.1 C40.1 C41.1 C42.1 C43.1 C44.1 C45.1 C46.1 C47.1 C48.1 C49.1 L6.2
NetC73_1: C73.1 U6.7(SS)
NetL5_1: L5.1 U8.2(SW)
NetR50_0: R50.0 U6.3(PG)
NetR51_0: R51.0 U7.8(PG)
NetR52_0: R52.0 R54.1 U7.7(FB)
NetR53_0: R53.0 R55.1 U6.8(FB)

### Notes on the sheet
- (near U6) V3P3
- (near U7) V1P2

### Library data of the parts
C33 C34 = T491A: Solid Tantalum Chip Capacitor, Standard T491 Series - Industrial Grade; Published: 17-Jul-2002; LatestRevisionDate: 19-Mar-2004; LatestRevisionNote: Silkscreen dimensions re-sized.; DatasheetDocument: Mar-2001; PackageDocument: Mar-2001; PackageReference: A; Publisher: Altium Limited; Code_JEITA: 3216-18; ComponentLink1Description: Manufacturer Link; ComponentLink1URL: http://www.kemet.com/; ComponentLink2Description: Datasheet; ComponentLink2URL: http://www.kemet.com/kemet/web/homepage/kechome.nsf/vapubfilesname/F3102TA.pdf/$file/F3102TA.pdf
C35 C36 = T495D: Solid Tantalum Chip Capacitor, Standard T495 Series - Low ESR, Surge Robust; Published: 17-Jul-2002; LatestRevisionDate: 19-Mar-2004; LatestRevisionNote: Silkscreen dimensions re-sized.; DatasheetDocument: Mar-2001; PackageDocument: Mar-2001; PackageReference: D; Publisher: Altium Limited; Code_JEITA: 7343-31; ComponentLink1Description: Manufacturer Link; ComponentLink1URL: http://www.kemet.com/; ComponentLink2Description: Datasheet; ComponentLink2URL: http://www.kemet.com/kemet/web/homepage/kechome.nsf/vapubfilesname/F3102TA.pdf/$file/F3102TA.pdf
C74 C75 = Capacitor: Value: C?
J2 = DC-Power Jack: pin to pad: V+>1 V->2+3
U6 = TPS74801DRCR: Single Output LDO, 1.5 A, Adjustable 0.8 to 3.6 V Output, 0.8 to 5.5 V Input, with Programmable Soft Start, 10-pin SON (DRC), -40 to 125 degC, Green (RoHS & no Sb/Br); Manufacturer: Texas Instruments; Accuracy(%): 2; Iout(Max)(A): 1.5; Iq(Typ)(mA): 1; Power Good: TRUE; Rating: Catalog; SubFamily: Single Channel LDO; Vdo(Typ)(mV): 60; Vin(Max)(V): 5.5; Vin(Min)(V): 0.8; Vout Adj(Max)(V): 3.6; DatasheetVersion: SBVS074J; PackageVersion: 4204102-3/L; PackageReference: DRC10-2400X1650TP; PackageDescription: 10-Pin Plastic Small Outline, Body 3 x 3 mm, Pitch 0.5 mm; Supplier 1: Digi-Key; Supplier Part Number 1: 296-21563-2-ND; Supplier 2: Digi-Key; Supplier Part Number 2: 296-21563-1-ND; Supplier 3: Digi-Key; Supplier Part Number 3: 296-21563-6-ND; Supplier 4: Newark; Supplier Part Number 4: 30M1868; Supplier 5: Mouser; Supplier Part Number 5: 595-TPS74801DRCR; Eco-Plan: Green (RoHS & no Sb/Br); Vout Adj(Min)(V): 0.8; Mounting Technology: Surface Mount; PartNumber: TPS74801DRCR; ComponentLink1Description: Manufacturer URL; ComponentLink1URL: http://www.ti.com/; ComponentLink2Description: Datasheet; ComponentLink2URL: http://www.ti.com/general/docs/lit/getliterature.tsp?genericPartNumber=TPS74801&fileType=pdf; ComponentLink3Description: Package Specification; ComponentLink3URL: http://www.ti.com/litv/pdf/mpds117k; ComponentLink4Description: URL Link1; ComponentLink4URL: Samples URL:http://www.ti.com/product/tps74801#samples
U7 = TPS76801QD: Single Output Fast Transient Response LDO, 1 A, Adjustable 1.2 to 5.5 V Output, 2.7 to 10 V Input, with Low IQ, 8-pin SOIC (D), -40 to 125 degC, Green (RoHS & no Sb/Br); Manufacturer: Texas Instruments; Accuracy(%): 2; Iout(Max)(A): 1; Iq(Typ)(mA): 0.08; Power Good: TRUE; SubFamily: Single Channel LDO; Vdo(Typ)(mV): 230; Vin(Max)(V): 10; Vin(Min)(V): 2.7; Vout Adj(Max)(V): 5.5; Vout Adj(Min)(V): 1.2; DatasheetVersion: SLVS211L; PackageVersion: 4040047-3/M; PackageReference: D8; PackageDescription: 8-Pin Plastic Small Outline, Body 4.9 x 3.9 mm, Pitch 1.27 mm; Supplier 1: Digi-Key; Supplier Part Number 1: 296-2743-5-ND; Supplier 2: Farnell; Supplier Part Number 2: 8461473; Supplier 3: Mouser; Supplier Part Number 3: 595-TPS76801QD; Eco-Plan: Green (RoHS & no Sb/Br); Mounting Technology: Surface Mount; Code_JEDEC: MS-012; PartNumber: TPS76801QD; ComponentLink1Description: Manufacturer URL; ComponentLink1URL: http://www.ti.com/; ComponentLink2Description: Datasheet; ComponentLink2URL: http://www.ti.com/general/docs/lit/getliterature.tsp?genericPartNumber=TPS76801&fileType=pdf; ComponentLink3Description: Package Specification; ComponentLink3URL: http://www.ti.com/litv/pdf/msoi002j
U8 = TPS62231DRYT: Buck Step Down Regulator with 2.05 to 6 V Input and 1.8 V Output, -40 to 85 degC, 6-Pin SON (DRY), Green (RoHS & no Sb/Br); Manufacturer: Texas Instruments; Duty Cycle(Max)(%): 100; Iout(Max)(A): 0.5; Iq(Typ)(mA): 0.022; Preset Vout(V): 1.8; Rating: Catalog; Regulated Outputs(#): 1; SubFamily: Step-Down Regulator; Switch Current Limit(Typ)(A): 0.84; Synchronous Rectification: TRUE; Vin(Max)(V): 6; Vin(Min)(V): 2.05; DatasheetVersion: SLVS941E; PackageVersion: revF, Dec-2011; PackageReference: DRY6; PackageDescription: 6-Pin Plastic Small Outline No-Lead, 1 x 1.45 x 0.6 mm Body, 0.5 mm Pitch; Supplier 1: Digi-Key; Supplier Part Number 1: 296-24485-2-ND; Supplier 2: Digi-Key; Supplier Part Number 2: 296-24485-1-ND; Supplier 3: Digi-Key; Supplier Part Number 3: 296-24485-6-ND; Supplier 4: Farnell; Supplier Part Number 4: 1735598; Supplier 5: Newark; Supplier Part Number 5: 07R8108; Supplier 6: Mouser; Supplier Part Number 6: 595-TPS62231DRYT; Eco-Plan: Green (RoHS & no Sb/Br); Topology: Buck; Vout(Max)(V): 1.8; Vout(Min)(V): 1.8; Mounting Technology: Surface Mount; PartNumber: TPS62231DRYT; ComponentLink1Description: Datasheet; ComponentLink1URL: http://www.ti.com/general/docs/lit/getliterature.tsp?genericPartNumber=TPS62231&fileType=pdf; ComponentLink2Description: Package Specification; ComponentLink2URL: http://www.ti.com/litv/pdf/mpds221e; ComponentLink3Description: URL Link1; ComponentLink3URL: Samples URL:http://www.ti.com/product/tps62231#samples

## Sheet Connectors.SchDoc
size A
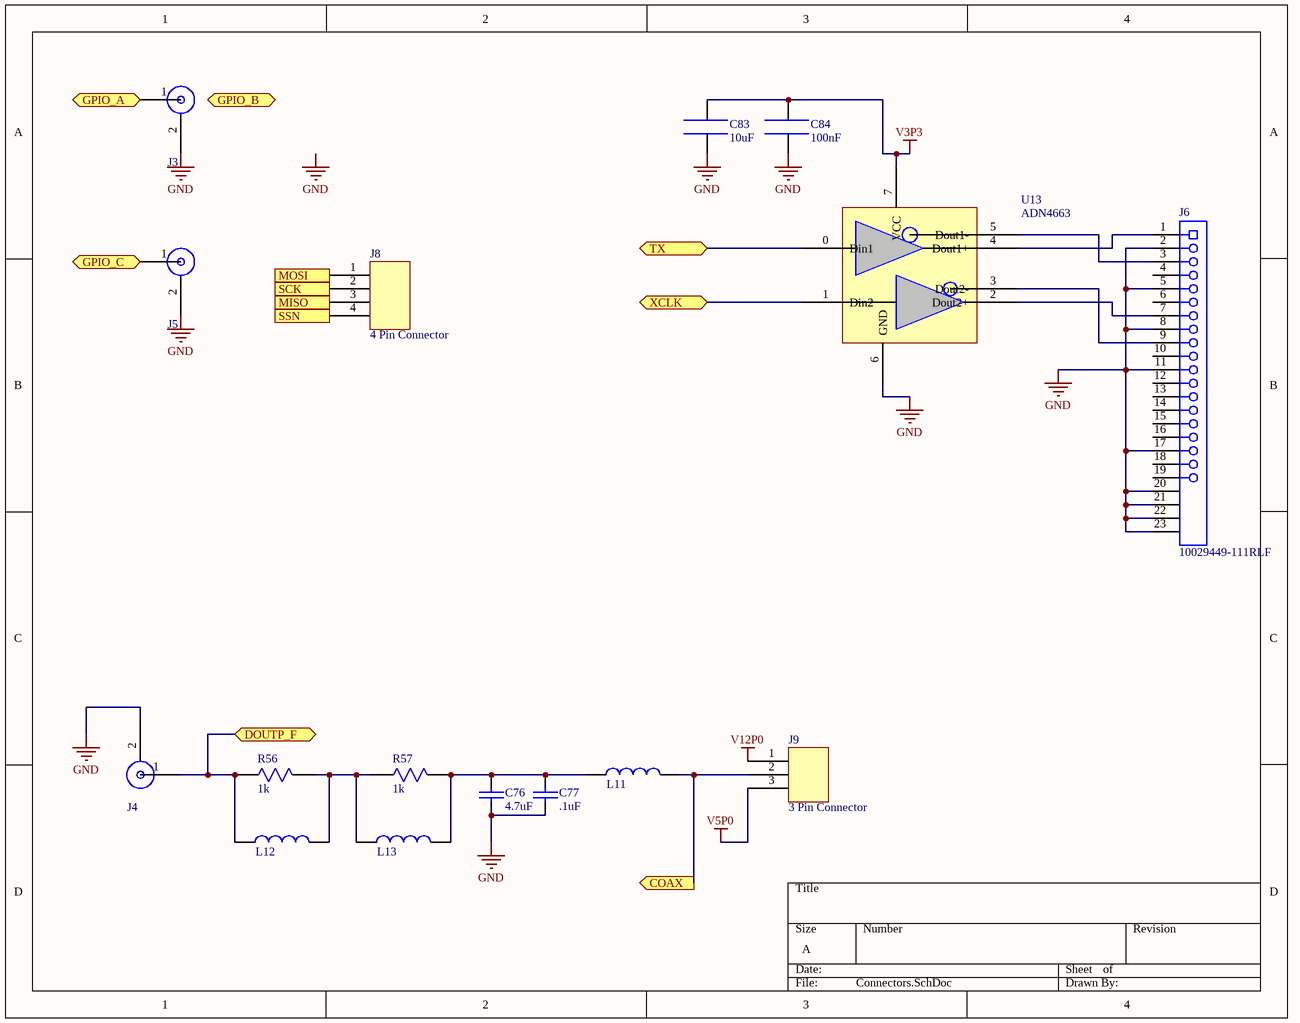
[diagram p5: Connectors.SchDoc]

### Parts
C76  4.7uF  [SMD Capacitor 0603]
C77  .1uF  [SMD CAP 0402]
C83  value 10uF  [SMD Capacitor 0603]  (hidden comment: Capacitor)
C84  value 100nF  [SMD Capacitor 0603]  (hidden comment: Capacitor)
J3  SMA  [SMA Right Angle Through Hole]  (value not drawn)
J4  SMA  [SMA Right Angle Through Hole]  (value not drawn)
J5  SMA  [SMA Right Angle Through Hole]  (value not drawn)
J6  10029449-111RLF  [FCI-10029449-111RLF_V]
J8  4 Pin Connector  [4Pin Verital 0.1"]
J9  3 Pin Connector  [3Pin Verital 0.1" JUMOER]
L11  Ferrite Bead  [BLM18KG601SN1D]  (value not drawn)
L12  Ferrite Bead  [CIG21L4R7MNE]  (value not drawn)
L13  Ferrite Bead  [CBC3225T101MR]  (value not drawn)
R56  1k  [SMD Resistor 0603]
R57  1k  [SMD Resistor 0603]
U13  ADN4663  [SOIC127P600X175-8N]

### Ports
COAX (out), DOUTP_F (bidir), GPIO_A (bidir), GPIO_B (bidir), GPIO_C (bidir), MISO (out), MOSI (in), SCK (in), SSN (in), TX (bidir), XCLK (bidir)

### Nets
GND: C76.1 C77.1 C83.0 C84.0 J3.2 J4.2 J5.2 J6.2 J6.5 J6.8 J6.11 J6.17 J6.20(SHLD1) J6.21(SHLD2) J6.22(SHLD3) J6.23(SHLD4) U13.6(GND)
V3P3: C83.1 C84.1 U13.7(VCC)  [project net VDDIO1]
V5P0: J9.3
V12P0: J9.1
NetC21_1: J4.1 L12.1 R56.0 ; port DOUTP_F
NetC76_0: C76.0 C77.0 L11.1 L13.2 R57.1
NetJ3_1: J3.1 ; port GPIO_A
NetJ5_1: J5.1 ; port GPIO_C
NetJ6_1: J6.1 U13.4(Dout1+)
NetJ6_3: J6.3 U13.5(Dout1-)
NetJ6_7: J6.7 U13.2(Dout2+)
NetJ6_9: J6.9 U13.3(Dout2-)
NetJ8_1: J8.1 ; port MOSI
NetJ8_2: J8.2 ; port SCK
NetJ8_3: J8.3 ; port MISO
NetJ8_4: J8.4 ; port SSN
NetJ9_2: J9.2 L11.2 ; port COAX
NetL12_2: L12.2 L13.1 R56.1 R57.0
NetU4_11: U13.1(Din2) ; port XCLK
NetU4_12: U13.0(Din1) ; port TX

Not connected (* = marked no-connect by the designer): J6 4 6 10 12 13 14 15 16 18 19

### Notes on the sheet
- Labels drawn without touching a wire or pin: GND

### Library data of the parts
C76 C77 = Capacitor: Value: C?
J6 = CMP-2000-05117-1: Surface Mount Type A HDMI Receptacle without Flange, 19 Positions, 0.5 mm Pitch, -55 to 85 degC, RoHS, Tape and Reel; Manufacturer: FCI; Gender: Female; Number of Positions / Contacts: 19; Contact Rating: 0.5A; Voltage Rating: 40V; Insulation Resistance: 100MOhms; RoHS: Details; Datasheet URL: https://datasheet.ciiva.com/851/10029449-851120.pdf; Termination Style: SMD; Contact Plating: Gold; Housing Material: Resin; Product Type: HDMI; Color: Black; Number of Positions: 19; Mounting Style: SMD/SMT; Packaging: Reel; Brand: FCI; Manufacturer URL: http://www.fci.com/; Contact Material: CopperAlloy; Orientation: Horizontal; Factory Pack Quantity: 400; Operating Temperature Range: -55Cto+85C; Product Category: HDMI,Displayport&DVIConnectors; Datasheet Version: Rev. S, 06/2012
R56 R57 = Resistor: Value: ?
U13 = DUAL_LVDS_TX: pin to pad: 0>2 1>3 2>6 3>5 4>7 5>8 6>4 7>1

## Sheet Reset.SchDoc
size A
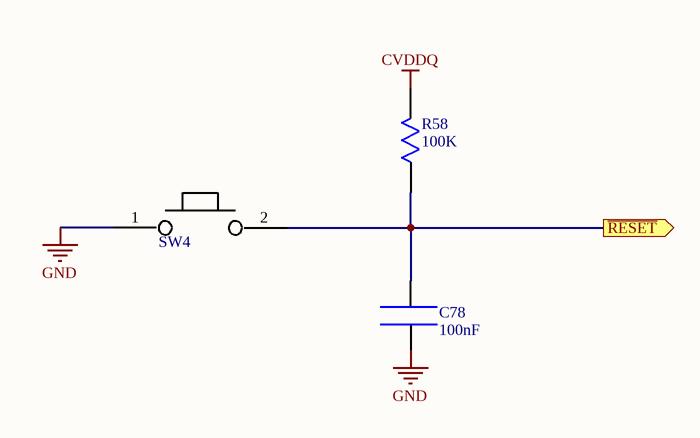
[diagram p6: Reset.SchDoc]

### Parts
C78  value 100nF  [SMD Capacitor 0603]  (hidden comment: Capacitor)
R58  value 100K  [SMD Resistor 0603]  (hidden comment: Resistor)
SW4  PB_Switch  [EVQPAC07K]  (value not drawn)

### Ports
~{RESET} (out)

### Nets
CVDDQ: R58.1
GND: C78.0 SW4.1
NetC78_1: C78.1 R58.0 SW4.2 ; port ~{RESET}

### Library data of the parts
SW4 = PB_Switch: Push Button Switch

## Sheet Clocks.SchDoc
size A
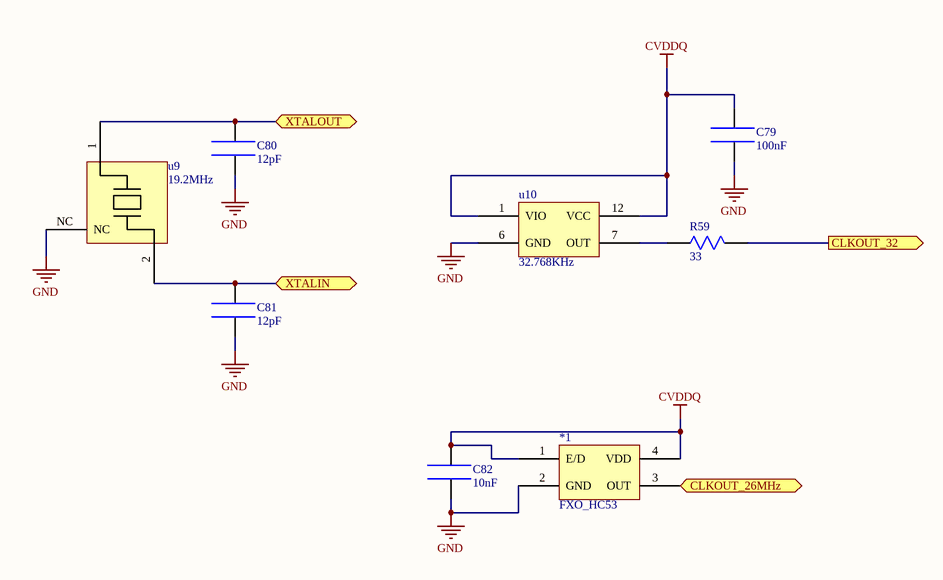
[diagram p7: Clocks.SchDoc]

### Parts
*1  FXO_HC53  [FXO_HC53]
C79  value 100nF  [SMD Capacitor 0603]  (hidden comment: Capacitor)
C80  value 12pF  [SMD Capacitor 0603]  (hidden comment: Capacitor)
C81  value 12pF  [SMD Capacitor 0603]  (hidden comment: Capacitor)
C82  value 10nF  [SMD Capacitor 0603]  (hidden comment: Capacitor)
R59  value 33  [SMD Resistor 0603]  (hidden comment: Resistor)
u9  Freq: 19.2MHz  [NX3225SA]  (hidden comment: CrystalOSC_General)
u10  Freq: 32.768KHz  [SG-3040LC]  (hidden comment: SG-3040LC)

### Ports
CLKOUT_26MHz (out), CLKOUT_32 (out), XTALIN, XTALOUT

### Nets
CVDDQ: *1.1(E/D) *1.4(VDD) C79.1 C82.1 u10.1(VIO) u10.12(VCC)
GND: *1.2(GND) C79.0 C80.0 C81.0 C82.0 u9.NC u10.6(GND)
CLKIN: *1.3(OUT) ; port CLKOUT_26MHz
CLKIN_32: R59.1 ; port CLKOUT_32
XTALIN: C81.1 u9.2 ; port XTALIN
XTALOUT: C80.1 u9.1 ; port XTALOUT
NetR59_0: R59.0 u10.7(OUT)

## Sheet LEDs.SchDoc
size A
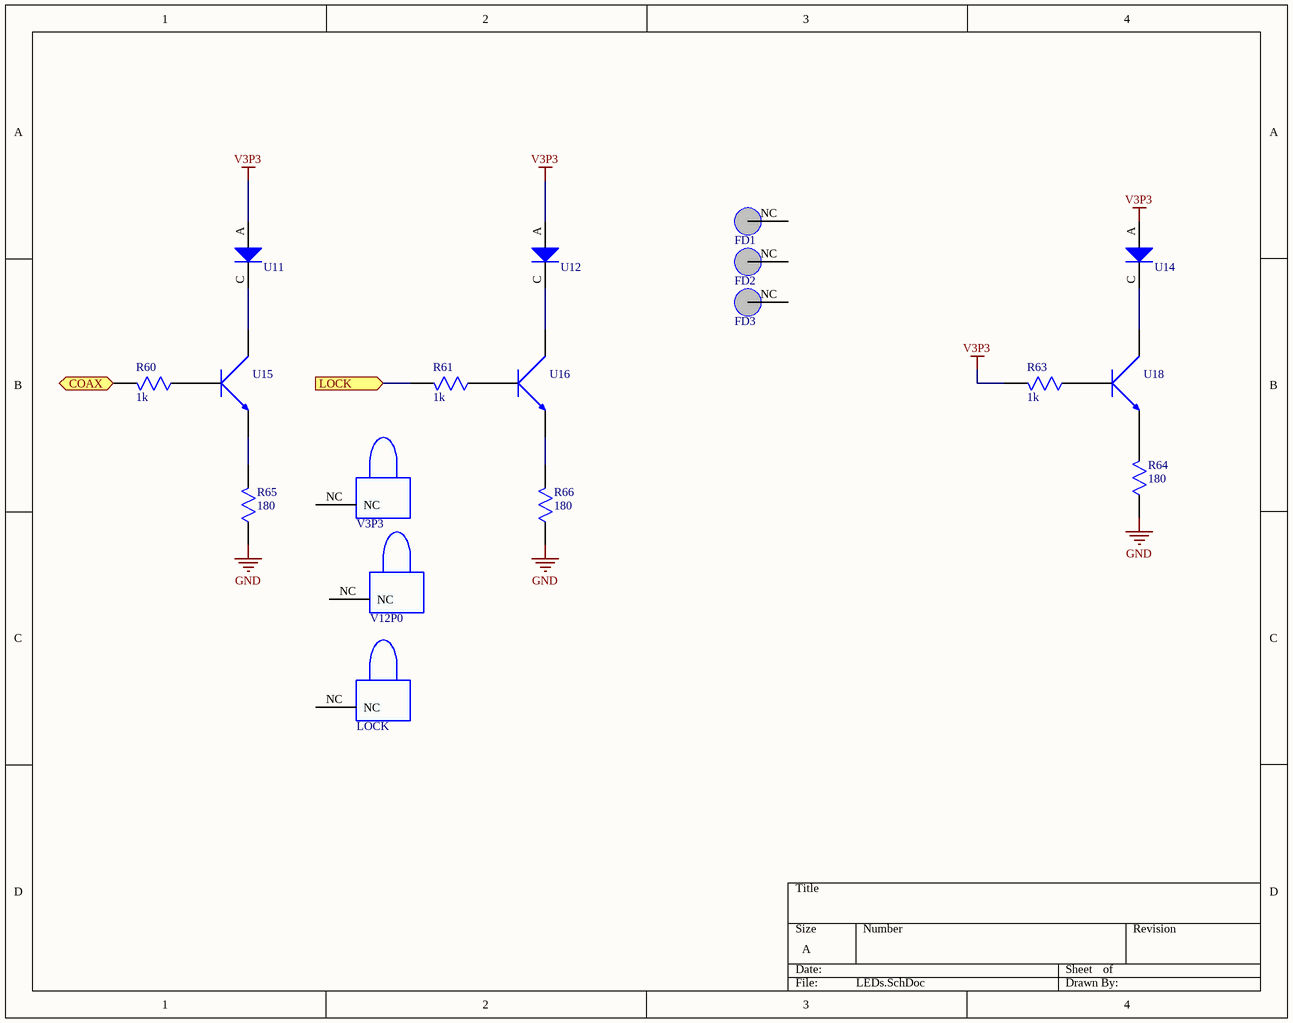
[diagram p8: LEDs.SchDoc]

### Parts
FD1  Fiducial Mark  [Fiducial Round]  (value not drawn)
FD2  Fiducial Mark  [Fiducial Round]  (value not drawn)
FD3  Fiducial Mark  [Fiducial Round]  (value not drawn)
LOCK  Light Pipe  [Light Pipe]  (value not drawn)
R60  value 1k  [SMD Resistor 0603]  (hidden comment: Resistor)
R61  value 1k  [SMD Resistor 0603]  (hidden comment: Resistor)
R63  value 1k  [SMD Resistor 0603]  (hidden comment: Resistor)
R64  value 180  [SMD Resistor 0603]  (hidden comment: Resistor)
R65  value 180  [SMD Resistor 0603]  (hidden comment: Resistor)
R66  value 180  [SMD Resistor 0603]  (hidden comment: Resistor)
U11  LED  [LED_0603]  (value not drawn)
U12  LED  [LED_0603]  (value not drawn)
U14  LED  [LED_0603]  (value not drawn)
U15  transistor NPN  [SOT23127P600-8N]  (value not drawn)
U16  transistor NPN  [SOT23127P600-8N]  (value not drawn)
U18  transistor NPN  [SOT23127P600-8N]  (value not drawn)
V3P3  Light Pipe  [Light Pipe]  (value not drawn)
V12P0  Light Pipe  [Light Pipe]  (value not drawn)

### Ports
COAX (in), LOCK (in)

### Nets
GND: R64.0 R65.0 R66.0
V3P3: R63.1 U11.A U12.A U14.A  [project net VDDIO1]
NetJ9_2: R60.1 ; port COAX
NetR60_0: R60.0 U15.B
NetR61_0: R61.0 U16.B
NetR61_1: R61.1 ; port LOCK
NetR63_0: R63.0 U18.B
NetR64_1: R64.1 U18.E
NetR65_1: R65.1 U15.E
NetR66_1: R66.1 U16.E
NetU11_C: U11.C U15.C
NetU12_C: U12.C U16.C
NetU14_C: U14.C U18.C

Not connected (* = marked no-connect by the designer): FD1 NC; FD2 NC; FD3 NC; LOCK NC; V3P3 NC; V12P0 NC

## Nets that join several sheets
AVDD: EZ_FX3USB (U2.A7), Power Components (C52.1 C53.1 L7.2)
CVDDQ: EZ_FX3USB (R26.1 R27.1 R28.1 U2.B6), Power Components (C50.1 C51.1 L8.1), Reset (R58.1), Clocks (6 pins)
GND: Deserializer (34 pins), EZ_FX3USB (38 pins), I2C_EEPROM (7 pins), Power Components (51 pins), Connectors (17 pins), Reset (C78.0 SW4.1), Clocks (7 pins), LEDs (R64.0 R65.0 R66.0)
U3RX_VDDQ: EZ_FX3USB (U2.A2), Power Components (C54.1 C55.1 L9.2)
U3TX_VDDQ: EZ_FX3USB (U2.B5), Power Components (C56.1 C57.1 L10.2)
USB3_VBUS: EZ_FX3USB (C5.1 U2.E11 U3.5), Power Components (C69.1)
V5P0: EZ_FX3USB (C4.1 L1.2 R33.1 U3.1), Power Components (13 pins), Connectors (J9.3)
V12P0: Power Components (J2.V+), Connectors (J9.1)
VDD: EZ_FX3USB (8 pins), Power Components (12 pins)
VDDD: Deserializer (14 pins), Power Components (C75.0 L5.2 U8.6)
VDDIO1: Deserializer (13 pins), EZ_FX3USB (12 pins), I2C_EEPROM (6 pins), Power Components (21 pins), Connectors (C83.1 C84.1 U13.7), LEDs (R63.1 U11.A U12.A U14.A)
CLKIN: EZ_FX3USB (U2.D7), Clocks (*1.3)
CLKIN_32: EZ_FX3USB (U2.D6), Clocks (R59.1)
DQ0: Deserializer (U4.24), EZ_FX3USB (R29.1)
DQ1: Deserializer (U4.23), EZ_FX3USB (R25.1)
DQ2: Deserializer (U4.22), EZ_FX3USB (R24.1)
DQ3: Deserializer (U4.21), EZ_FX3USB (R23.1)
DQ4: Deserializer (U4.19), EZ_FX3USB (R22.1)
DQ5: Deserializer (U4.18), EZ_FX3USB (R21.1)
DQ6: Deserializer (U4.16), EZ_FX3USB (R20.1)
DQ7: Deserializer (U4.15), EZ_FX3USB (R19.1)
DQ8: Deserializer (U4.14), EZ_FX3USB (R67.1)
DQ9: Deserializer (U4.13), EZ_FX3USB (R62.1)
NetC21_1: Deserializer (C21.1), Connectors (J4.1 L12.1 R56.0)
NetC78_1: EZ_FX3USB (U2.C5), Reset (C78.1 R58.0 SW4.2)
NetJ3_1: EZ_FX3USB (R11.1), Connectors (J3.1)
NetJ5_1: EZ_FX3USB (R15.1), Connectors (J5.1)
NetJ8_1: EZ_FX3USB (U2.D5), Connectors (J8.1)
NetJ8_2: EZ_FX3USB (U2.D4), Connectors (J8.2)
NetJ8_3: EZ_FX3USB (U2.C2), Connectors (J8.3)
NetJ8_4: EZ_FX3USB (U2.C1), Connectors (J8.4)
NetJ9_2: Connectors (J9.2 L11.2), LEDs (R60.1)
NetR9_1: Deserializer (U4.9), EZ_FX3USB (R9.1)
NetR10_1: Deserializer (U4.10), EZ_FX3USB (R10.1)
NetR12_0: Deserializer (U4.2), EZ_FX3USB (R12.0 U2.D9), I2C_EEPROM (U5.6)
NetR14_0: Deserializer (U4.1), EZ_FX3USB (R14.0 U2.D10), I2C_EEPROM (U5.5)
NetR18_1: Deserializer (U4.8), EZ_FX3USB (R18.1)
NetR61_1: Deserializer (U4.48), LEDs (R61.1)
NetU4_11: Deserializer (U4.11), Connectors (U13.1)
NetU4_12: Deserializer (U4.12), Connectors (U13.0)
XTALIN: EZ_FX3USB (U2.C6), Clocks (C81.1 u9.2)
XTALOUT: EZ_FX3USB (U2.C7), Clocks (C80.1 u9.1)